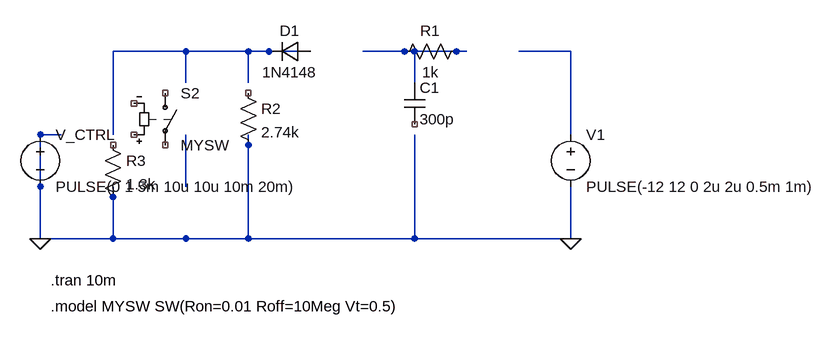
[diagram p0: schematic Teste_novo.asc]
Teste_novo.asc, the LTspice schematic file:
Version 4.1
SHEET 1 1000 800
WIRE 32 -208 -48 -208
WIRE -128 -208 -208 -208
WIRE -208 -208 -288 -208
WIRE -208 -160 -208 -208
WIRE -208 80 -208 -80
WIRE -368 -208 -464 -208
WIRE -464 -208 -560 -208
WIRE -464 -160 -464 -208
WIRE -464 80 -464 -80
WIRE -560 -208 -560 -160
WIRE -560 -80 -560 0
WIRE -560 80 -560 80
WIRE 32 -80 32 -208
WIRE 32 80 32 0
WIRE 32 80 -208 80
WIRE -208 80 -464 80
WIRE -464 80 -560 80
WIRE -672 80 -560 80
WIRE -672 80 -672 0
WIRE -672 -80 -672 -208
WIRE -560 -208 -672 -208
WIRE -784 -80 -784 80
WIRE -784 -80 -752 -80
WIRE -784 80 -672 80
WIRE -672 0 -672 80
FLAG 32 80 0
FLAG -784 80 0
SYMBOL voltage 32 -96 R0
WINDOW 123 0 0 Left 2
WINDOW 39 0 0 Left 2
SYMATTR InstName V1
SYMATTR Value PULSE(-12 12 0 2u 2u 0.5m 1m)
SYMBOL res -128 -224 R90
WINDOW 0 0 56 VBottom 2
WINDOW 3 32 56 VTop 2
SYMATTR InstName R1
SYMATTR Value 1k
SYMBOL cap -224 -160 R0
SYMATTR InstName C1
SYMATTR Value 300p
SYMBOL diode -368 -224 R90
WINDOW 0 0 32 VBottom 2
WINDOW 3 32 32 VTop 2
SYMATTR InstName D1
SYMATTR Value 1N4148
SYMBOL res -480 -160 R0
SYMATTR InstName R2
SYMATTR Value 2.74k
SYMBOL sw -592 -160 R0
SYMATTR InstName S2
SYMATTR Value MYSW
SYMBOL res -688 -80 R0
SYMATTR InstName R3
SYMATTR Value 1.3k
SYMBOL voltage -784 -96 R0
SYMATTR InstName V_CTRL
SYMATTR Value PULSE(0 1 5m 10u 10u 10m 20m)
TEXT -768 144 Left 2 !.tran 10m
TEXT -768 184 Left 2 !.model MYSW SW(Ron=0.01 Roff=10Meg Vt=0.5)

The netlist it stands for:
* Teste_novo.asc
V1 N001 0 PULSE(-12 12 0 2u 2u 0.5m 1m)
R1 N002 N002 1k
C1 N002 NC_01 300p
D1 N003 N003 1N4148
R2 NC_02 0 2.74k
S2 NC_03 NC_04 NC_05 NC_06 MYSW
R3 NC_07 0 1.3k
V_CTRL 0 0 PULSE(0 1 5m 10u 10u 10m 20m)
.model D D
.lib standard.dio
.tran 10m
.model MYSW SW(Ron=0.01 Roff=10Meg Vt=0.5)
.backanno
.end